# EAGLE schematic schaltplan 1.0 (EAGLE 7.2.0)
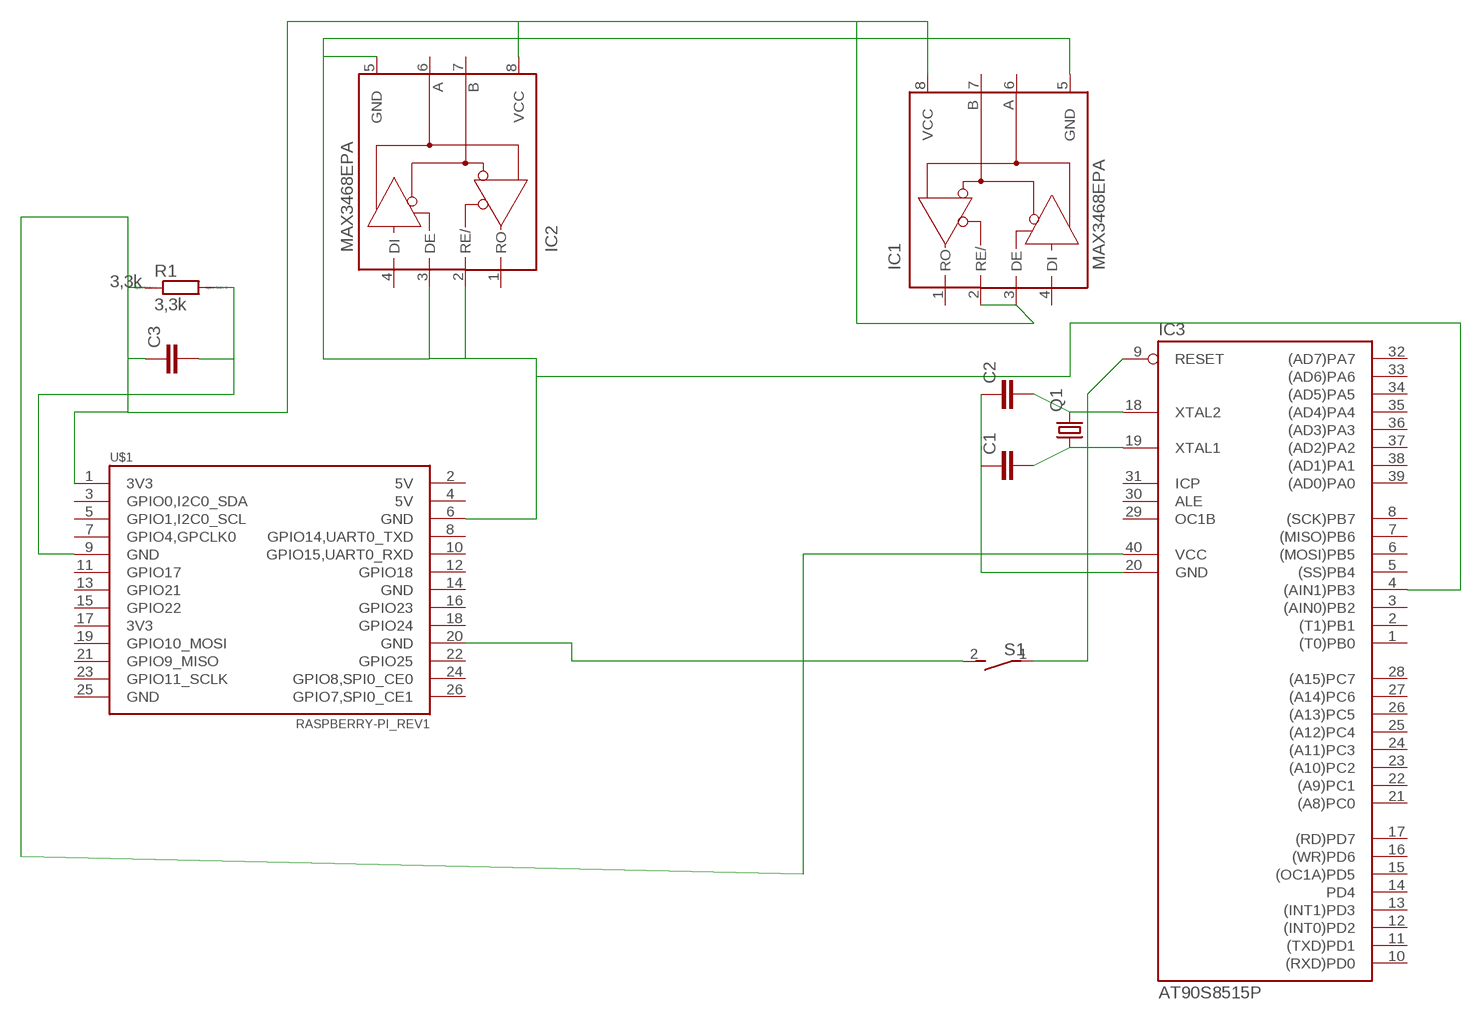
[diagram p0: schematic, sheet 1]

## Parts
C1  C2.5/5  [C2.5-5]
C2  C2.5/5  [C2.5-5]
C3  C2.5/5  [C2.5-5]
IC1  MAX3468EPA  [DIL08]
IC2  MAX3468EPA  [DIL08]
IC3  AT90S8515P  [DIL40]
Q1  CRYSTALHC49U-V  [HC49U-V]
R1  3,3k  R0204/7  [0204/7]
S1  DS01E  [DS-01]
U$1  RASPBERRY-PI_REV1  [RASPBERRY-PI_REV1]

## Nets
N$2: C3.1 IC1.2(RE/) IC1.3(DE) IC1.8(VCC) IC2.8(VCC) IC3.40(VCC) R1.1 U$1.1(3V3)
N$3: C3.2 R1.2 U$1.9(GND)
N$4: C1.2 IC3.19(XTAL1) Q1.1
N$5: C2.2 IC3.18(XTAL2) Q1.2
N$6: C1.1 C2.1 IC3.20(GND)
N$9: IC1.5(GND) IC2.2(RE/) IC2.3(DE) IC2.5(GND) IC3.4((AIN1)PB3) U$1.6(GND)
N$10: IC3.9(RESET) S1.1
N$11: S1.2 U$1.20(GND)
Unconnected: IC1.1(RO) IC1.4(DI) IC1.6(A) IC1.7(B) IC2.1(RO) IC2.4(DI) IC2.6(A) IC2.7(B) IC3.1((T0)PB0) IC3.2((T1)PB1) IC3.3((AIN0)PB2) IC3.5((SS)PB4) IC3.6((MOSI)PB5) IC3.7((MISO)PB6) IC3.8((SCK)PB7) IC3.10((RXD)PD0) IC3.11((TXD)PD1) IC3.12((INT0)PD2) IC3.13((INT1)PD3) IC3.14(PD4) IC3.15((OC1A)PD5) IC3.16((WR)PD6) IC3.17((RD)PD7) IC3.21((A8)PC0) IC3.22((A9)PC1) IC3.23((A10)PC2) IC3.24((A11)PC3) IC3.25((A12)PC4) IC3.26((A13)PC5) IC3.27((A14)PC6) IC3.28((A15)PC7) IC3.29(OC1B) IC3.30(ALE) IC3.31(ICP) IC3.32((AD7)PA7) IC3.33((AD6)PA6) IC3.34((AD5)PA5) IC3.35((AD4)PA4) IC3.36((AD3)PA3) IC3.37((AD2)PA2) IC3.38((AD1)PA1) IC3.39((AD0)PA0) U$1.2(5V) U$1.3(GPIO0,I2C0_SDA) U$1.4(5V) U$1.5(GPIO1,I2C0_SCL) U$1.7(GPIO4,GPCLK0) U$1.8(GPIO14,UART0_TXD) U$1.10(GPIO15,UART0_RXD) U$1.11(GPIO17) U$1.12(GPIO18) U$1.13(GPIO21) U$1.14(GND) U$1.15(GPIO22) U$1.16(GPIO23) U$1.17(3V3) U$1.18(GPIO24) U$1.19(GPIO10_MOSI) U$1.21(GPIO9_MISO) U$1.22(GPIO25) U$1.23(GPIO11_SCLK) U$1.24(GPIO8,SPI0_CE0) U$1.25(GND) U$1.26(GPIO7,SPI0_CE1)

## Library data of the parts
C1-C3 = capacitor-wima:C: CAPACITOR naming: grid - package width
IC1 IC2 = maxim:MAX34*: +5V, Fail-Safe, 40Mbps, Profibus RS-485/RS-422 Transceivers Source: MAX3465-MAX3469.pdf; MPN: MAX3468EPA+; OC_FARNELL: unknown; OC_NEWARK: 78M5804
IC3 = atmel:AT90S8515P: MICROCONTROLLER 8 Kbytes FLASH 512 bytes SRAM 512 bytes EEPROM UART; OC_FARNELL: unknown; OC_NEWARK: unknown
Q1 = crystal:CRYSTAL: CRYSTAL; OC_FARNELL: 1666969; OC_NEWARK: unknown
R1 = eagle-ltspice:R: RESISTOR, European symbol; SPICEMODEL: 3,3k; SPICEPREFIX: R
S1 = switch-dil:DS01E: DIL/CODE SWITCH; OC_FARNELL: unknown; OC_NEWARK: unknown
U$1 = RaspberryPi:RASPBERRY-PI_REV1: Raspberry Pi Board <http://www.raspberrypi.org/> Jacques Lagnel V1.0 (beta) 2012 Mateusz Bawaj V1.1 (beta) 2012 Board dimension: Forum 3D model <http://www.raspberrypi.org/forum/general-discussion/mechanical-profile-3d-models?value=3d%20model&type=1&include=1&search=1&ret=all> The GPIO Connector (P1): http://elinux.org/RPi_Low-level_peripherals